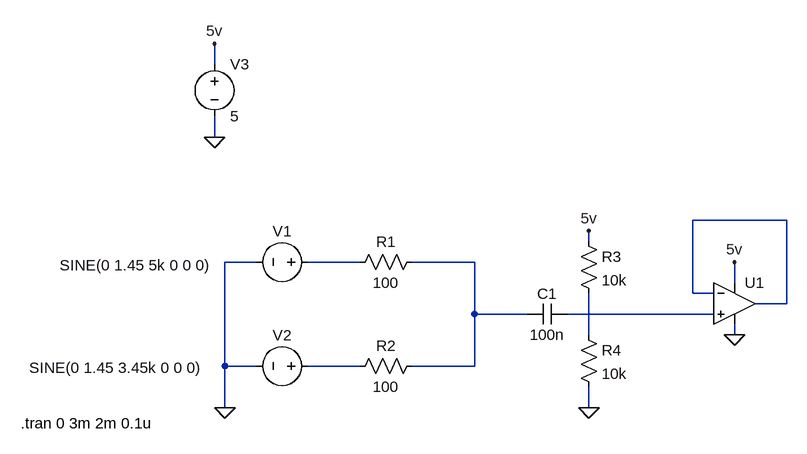
[diagram p0: schematic stereo_to_mono.asc]
stereo_to_mono.asc, the LTspice schematic file:
Version 4
SHEET 1 1028 680
WIRE 16 -192 16 -224
WIRE 16 -80 16 -112
WIRE 896 48 752 48
WIRE 592 80 592 64
WIRE 80 112 32 112
WIRE 240 112 160 112
WIRE 416 112 320 112
WIRE 816 144 816 112
WIRE 752 160 752 48
WIRE 784 160 752 160
WIRE 896 176 896 48
WIRE 896 176 848 176
WIRE 416 192 416 112
WIRE 496 192 416 192
WIRE 784 192 560 192
WIRE 592 224 592 160
WIRE 816 224 816 208
WIRE 32 272 32 112
WIRE 80 272 32 272
WIRE 240 272 160 272
WIRE 416 272 416 192
WIRE 416 272 320 272
WIRE 32 336 32 272
WIRE 592 336 592 304
FLAG 32 336 0
FLAG 592 336 0
FLAG 16 -80 0
FLAG 16 -224 5v
FLAG 592 64 5v
FLAG 816 224 0
FLAG 816 112 5v
SYMBOL voltage 176 112 R90
WINDOW 0 -32 56 VBottom 2
WINDOW 3 -11 282 VTop 2
WINDOW 123 0 0 Left 0
WINDOW 39 0 0 Left 0
SYMATTR InstName V1
SYMATTR Value SINE(0 1.45 5k 0 0 0)
SYMBOL voltage 176 272 R90
WINDOW 0 -32 56 VBottom 2
WINDOW 3 -13 312 VTop 2
WINDOW 123 0 0 Left 0
WINDOW 39 0 0 Left 0
SYMATTR InstName V2
SYMATTR Value SINE(0 1.45 3.45k 0 0 0)
SYMBOL res 336 96 R90
WINDOW 0 0 56 VBottom 2
WINDOW 3 32 56 VTop 2
SYMATTR InstName R1
SYMATTR Value 100
SYMBOL res 336 256 R90
WINDOW 0 0 56 VBottom 2
WINDOW 3 32 56 VTop 2
SYMATTR InstName R2
SYMATTR Value 100
SYMBOL cap 560 176 R90
WINDOW 0 0 32 VBottom 2
WINDOW 3 32 32 VTop 2
SYMATTR InstName C1
SYMATTR Value 100n
SYMBOL res 576 64 R0
SYMATTR InstName R3
SYMATTR Value 10k
SYMBOL res 576 208 R0
SYMATTR InstName R4
SYMATTR Value 10k
SYMBOL voltage 16 -208 R0
WINDOW 123 0 0 Left 0
WINDOW 39 0 0 Left 0
SYMATTR InstName V3
SYMATTR Value 5
SYMBOL OpAmps\\UniversalOpAmp1 816 176 R0
SYMATTR InstName U1
TEXT -282 360 Left 2 !.tran 0 3m 2m 0.1u

The netlist it stands for:
* stereo_to_mono.asc
V1 N002 0 SINE(0 1.45 5k 0 0 0)
V2 N006 0 SINE(0 1.45 3.45k 0 0 0)
R1 N003 N002 100
R2 N003 N006 100
C1 N004 N003 100n
R3 5v N005 10k
R4 N005 0 10k
V3 5v 0 5
XU1 N004 N001 5v 0 N001 level1 Avol=1Meg GBW=10Meg Vos=0 En=0 Enk=0 In=0 Ink=0 Rin=500Meg  ; pins In+ In- V+ V- OUT
.tran 0 3m 2m 0.1u
.lib UniversalOpAmp1.lib
.backanno
.end